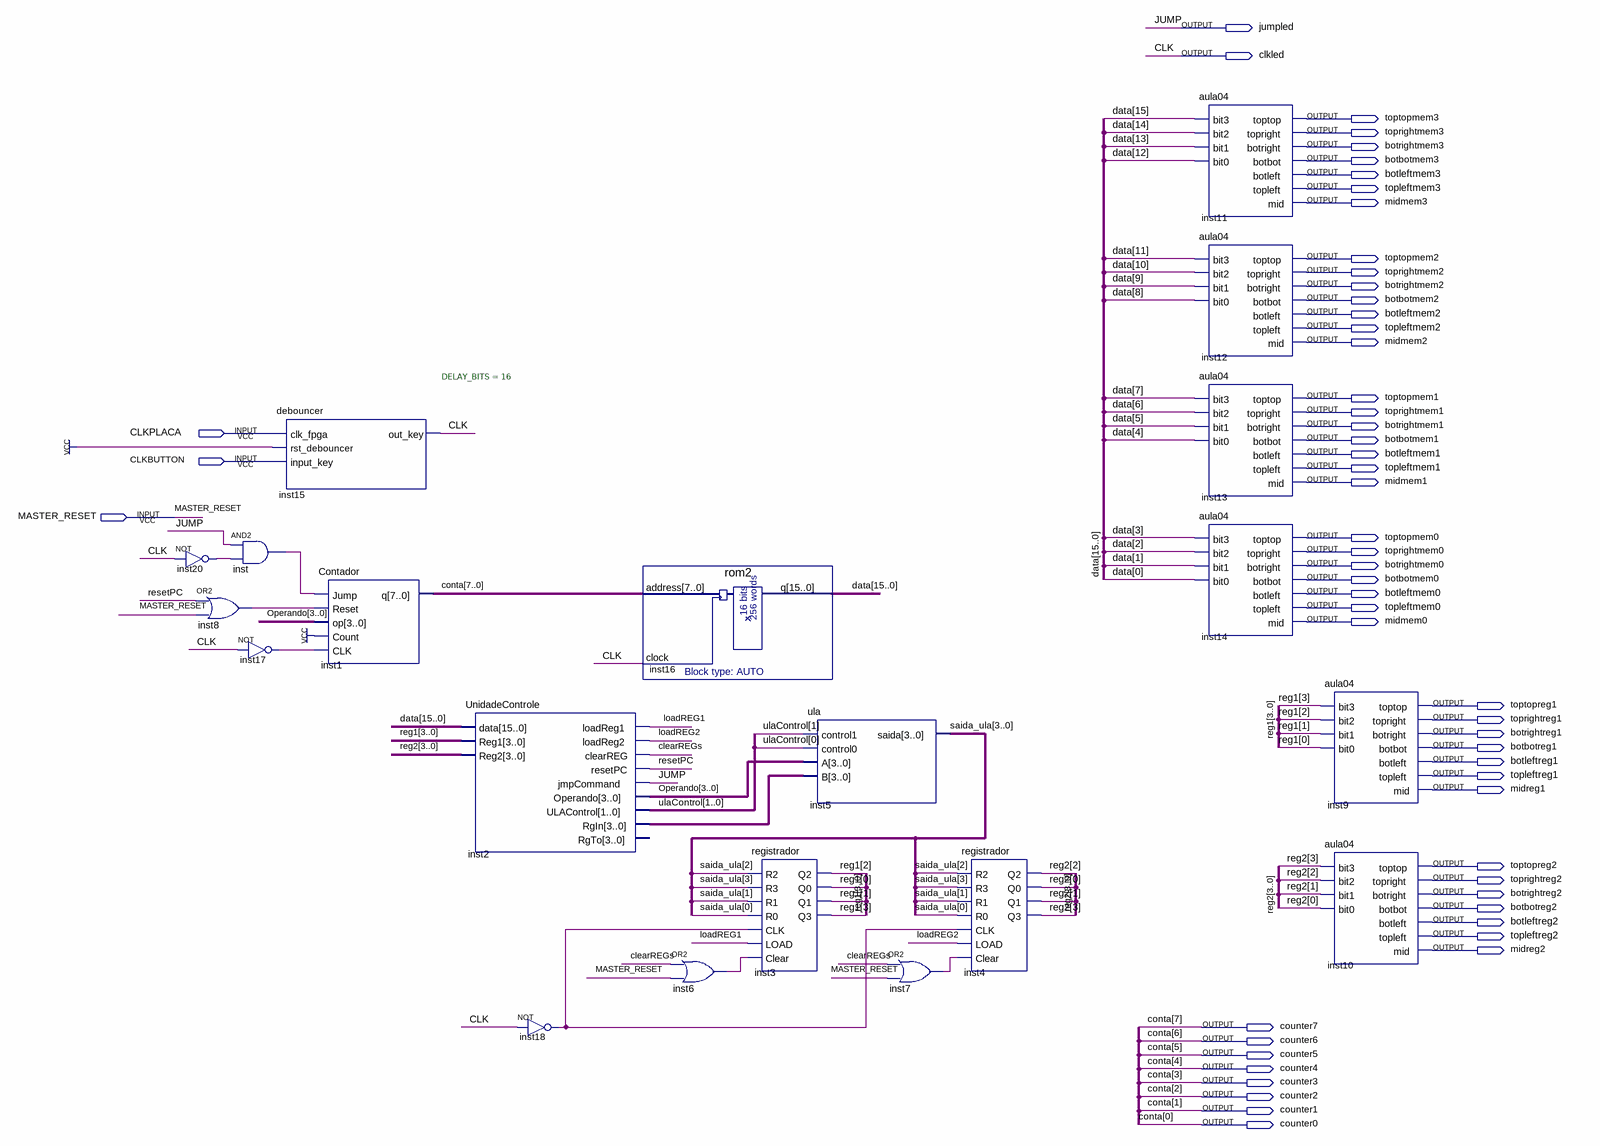
[diagram p0: schematic sheet]
// Quartus schematic tricolor.bdf as structural Verilog: 20 symbols, 55 pins
module tricolor (
  input  CLKPLACA,
  input  CLKBUTTON,
  input  MASTER_RESET,
  output jumpled,
  output clkled,
  output toptopmem3,
  output toprightmem3,
  output botrightmem3,
  output botbotmem3,
  output botleftmem3,
  output topleftmem3,
  output midmem3,
  output toptopmem2,
  output toprightmem2,
  output botrightmem2,
  output botbotmem2,
  output botleftmem2,
  output topleftmem2,
  output midmem2,
  output toptopmem1,
  output toprightmem1,
  output botrightmem1,
  output botbotmem1,
  output botleftmem1,
  output topleftmem1,
  output midmem1,
  output toptopmem0,
  output toprightmem0,
  output botrightmem0,
  output botbotmem0,
  output botleftmem0,
  output topleftmem0,
  output midmem0,
  output toptopreg1,
  output toprightreg1,
  output botrightreg1,
  output botbotreg1,
  output botleftreg1,
  output topleftreg1,
  output midreg1,
  output toptopreg2,
  output toprightreg2,
  output botrightreg2,
  output botbotreg2,
  output botleftreg2,
  output topleftreg2,
  output midreg2,
  output counter7,
  output counter6,
  output counter5,
  output counter4,
  output counter3,
  output counter2,
  output counter1,
  output counter0
);

  wire clearREGs, inst6_out, inst7_out, inst8_out, inst17_out, inst18_out, inst20_out, inst_out, loadREG1,
       loadREG2, resetPC;
  wire [1:0] ulaControl;
  wire [3:0] inst2_rgin, Operando, reg1, reg2, saida_ula;
  wire [15:0] data;

  not inst20 (inst20_out, clkled);
  or inst8 (inst8_out, resetPC, MASTER_RESET);
  and inst (inst_out, jumpled, inst20_out);
  not inst17 (inst17_out, clkled);
  debouncer #(.DELAY_BITS(16)) inst15 (
    .clk_fpga(CLKPLACA), .rst_debouncer(1'b1), .input_key(CLKBUTTON), .out_key(clkled));
  Contador inst1 (
    .Jump(inst_out), .Reset(inst8_out), .op(Operando), .Count(1'b1), .CLK(inst17_out),
    .q({counter7, counter6, counter5, counter4, counter3, counter2, counter1, counter0}));
  UnidadeControle inst2 (
    .data(data), .Reg1(reg1), .Reg2(reg2), .loadReg1(loadREG1), .loadReg2(loadREG2), .clearREG(clearREGs),
    .resetPC(resetPC), .jmpCommand(jumpled), .Operando(Operando), .ULAControl(ulaControl), .RgIn(inst2_rgin));  // open: RgTo
  not inst18 (inst18_out, clkled);
  rom2 inst16 (
    .address({counter7, counter6, counter5, counter4, counter3, counter2, counter1, counter0}),
    .clock(clkled), .q(data));
  or inst6 (inst6_out, clearREGs, MASTER_RESET);
  registrador inst3 (
    .R2(saida_ula[2]), .R3(saida_ula[3]), .R1(saida_ula[1]), .R0(saida_ula[0]), .CLK(inst18_out),
    .LOAD(loadREG1), .Clear(inst6_out), .Q2(reg1[2]), .Q0(reg1[0]), .Q1(reg1[1]), .Q3(reg1[3]));
  ula inst5 (.control1(ulaControl[1]), .control0(ulaControl[0]), .A(Operando), .B(inst2_rgin), .saida(saida_ula));
  or inst7 (inst7_out, clearREGs, MASTER_RESET);
  registrador inst4 (
    .R2(saida_ula[2]), .R3(saida_ula[3]), .R1(saida_ula[1]), .R0(saida_ula[0]), .CLK(inst18_out),
    .LOAD(loadREG2), .Clear(inst7_out), .Q2(reg2[2]), .Q0(reg2[0]), .Q1(reg2[1]), .Q3(reg2[3]));
  aula04 inst11 (
    .bit3(data[15]), .bit2(data[14]), .bit1(data[13]), .bit0(data[12]), .toptop(toptopmem3),
    .topright(toprightmem3), .botright(botrightmem3), .botbot(botbotmem3), .botleft(botleftmem3),
    .topleft(topleftmem3), .mid(midmem3));
  aula04 inst12 (
    .bit3(data[11]), .bit2(data[10]), .bit1(data[9]), .bit0(data[8]), .toptop(toptopmem2),
    .topright(toprightmem2), .botright(botrightmem2), .botbot(botbotmem2), .botleft(botleftmem2),
    .topleft(topleftmem2), .mid(midmem2));
  aula04 inst13 (
    .bit3(data[7]), .bit2(data[6]), .bit1(data[5]), .bit0(data[4]), .toptop(toptopmem1),
    .topright(toprightmem1), .botright(botrightmem1), .botbot(botbotmem1), .botleft(botleftmem1),
    .topleft(topleftmem1), .mid(midmem1));
  aula04 inst14 (
    .bit3(data[3]), .bit2(data[2]), .bit1(data[1]), .bit0(data[0]), .toptop(toptopmem0),
    .topright(toprightmem0), .botright(botrightmem0), .botbot(botbotmem0), .botleft(botleftmem0),
    .topleft(topleftmem0), .mid(midmem0));
  aula04 inst9 (
    .bit3(reg1[3]), .bit2(reg1[2]), .bit1(reg1[1]), .bit0(reg1[0]), .toptop(toptopreg1),
    .topright(toprightreg1), .botright(botrightreg1), .botbot(botbotreg1), .botleft(botleftreg1),
    .topleft(topleftreg1), .mid(midreg1));
  aula04 inst10 (
    .bit3(reg2[3]), .bit2(reg2[2]), .bit1(reg2[1]), .bit0(reg2[0]), .toptop(toptopreg2),
    .topright(toprightreg2), .botright(botrightreg2), .botbot(botbotreg2), .botleft(botleftreg2),
    .topleft(topleftreg2), .mid(midreg2));

  // Other names for the same wires on the sheet: CLK = clkled;
  //   conta[7:0] = {counter7, counter6, counter5, counter4, counter3, counter2, counter1, counter0}; JUMP = jumpled
endmodule
